# Altium project DIT_board.PrjPcb
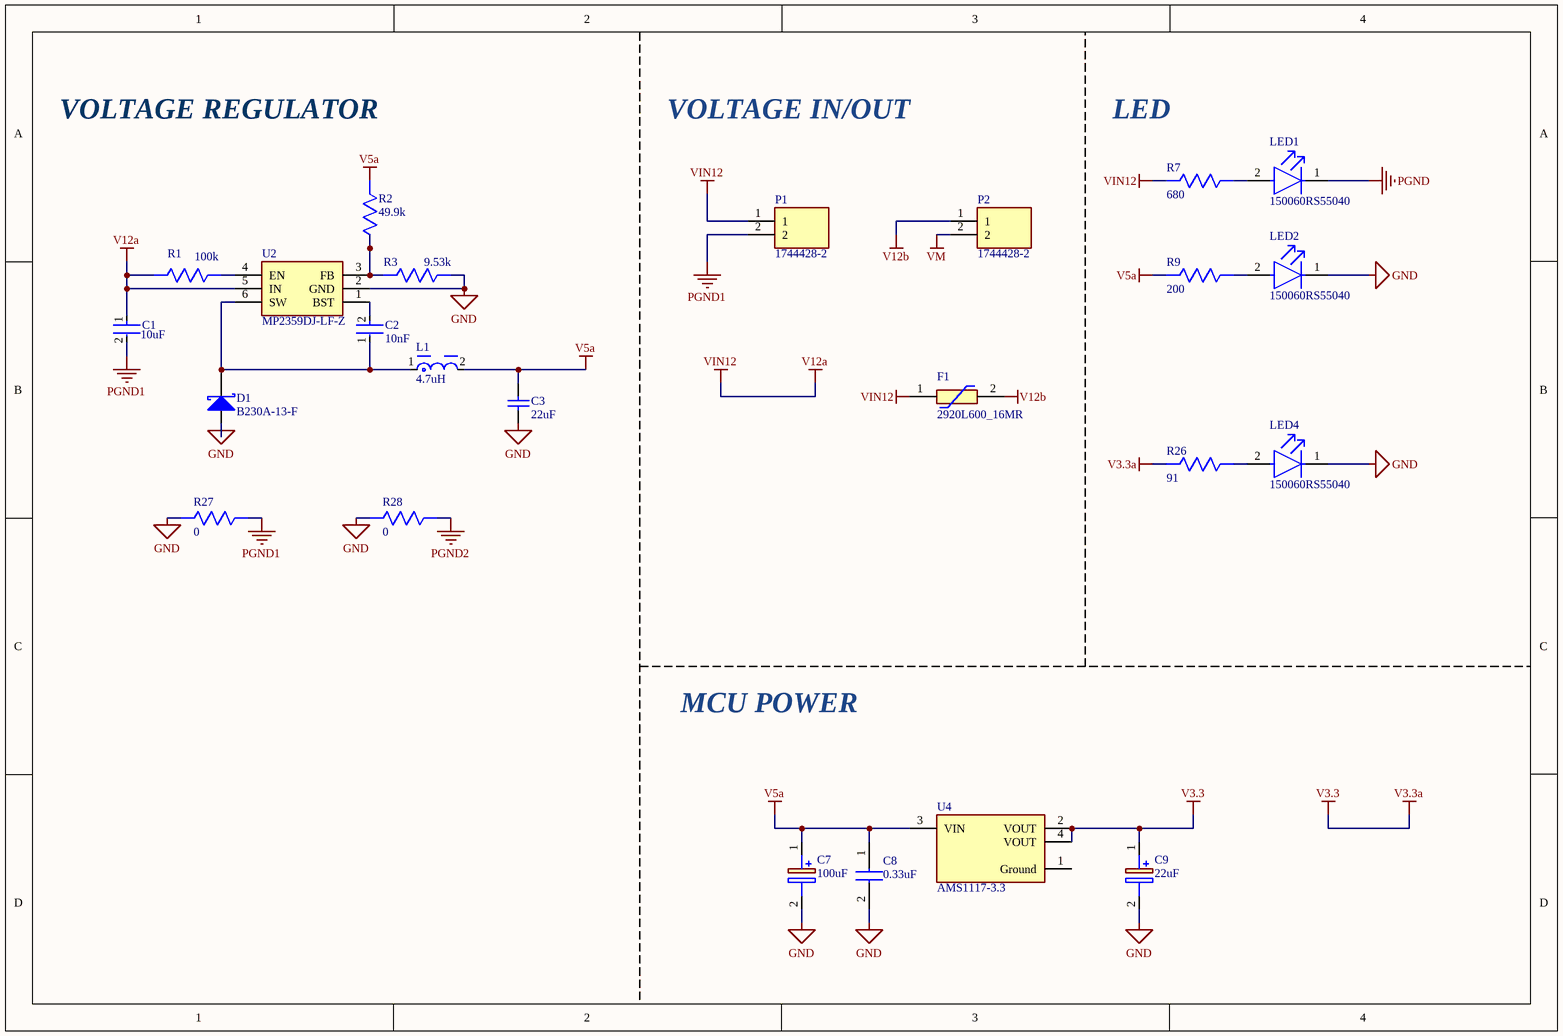
[diagram p0: VoltageRegulator.SchDoc]
4 sheets, 83 parts. Net scope: flat (ports and power ports of the same name join across sheets).
Board file: DIT_board.PcbDoc
Sheets:
  VoltageRegulator.SchDoc
  Motor.SchDoc
  STM32.SchDoc
  Communication.SchDoc

## Sheet VoltageRegulator.SchDoc
size A4; SheetNumber: 1; SheetTotal: 4

### Parts
C1  10uF  [FP-C1608-080-IPC_A]
C2  10nF  [FP-C1608-080-0_1-MFG]
C3  22uF  [CAPC1608X100X20ML10]
C7  100uF  [T495E]
C8  0.33uF  [C1608_Commercial]
C9  22uF  [T495C]
D1  B230A-13-F  [DIOD-SMA-2_V]
F1  2920L600_16MR  [FUSC7451X160N]
L1  4.7uH  [FP-7440530047-MFG]
LED1  150060RS55040  [FP-150060RS55040-MFG]
LED2  150060RS55040  [FP-150060RS55040-MFG]
LED4  150060RS55040  [FP-150060RS55040-MFG]
P1  1744428-2  [17444282]
P2  1744428-2  [17444282]
R1  100k  [RESC1608X55N]
R2  49.9k  [RESC1608X55N]
R3  9.53k  [RESC1608X55N]
R7  680  [RESC1608X55N]
R9  200  [RESC1608X55N]
R26  91  [RESC1608X55N]
R27  0  [RESC1608X55N]
R28  0  [RESC1608X55N]
U2  MP2359DJ-LF-Z  [SOT95P280X100-6N]
U4  AMS1117-3.3  [FP-AMS1117-IPC_C]

### Nets
GND: C3.1 C7.2(-) C8.2 C9.2(-) D1.1(A) LED2.1(C) LED4.1(C) R3.2 R27.1 R28.1 U2.2(GND)
PGND: LED1.1(C)
PGND1: C1.2 P1.2 R27.2
PGND2: R28.2
V3.3: C9.1(+) R26.1 U4.2(VOUT) U4.4(VOUT)  [also labelled V3.3a]
V5a: C3.2 C7.1(+) C8.1 L1.2 R2.1 R9.1 U4.3(VIN)
V12a: C1.1 F1.1 P1.1 R1.1 R7.1 U2.5(IN)  [also labelled VIN12]
V12b: F1.2 P2.1
VM: P2.2
NetC2_1: C2.1 D1.2(K) L1.1 U2.6(SW)
NetC2_2: C2.2 U2.1(BST)
NetLED1_2: LED1.2(A) R7.2
NetLED2_2: LED2.2(A) R9.2
NetLED4_2: LED4.2(A) R26.2
NetR1_2: R1.2 U2.4(EN)
NetR2_2: R2.2 R3.1 U2.3(FB)

Not connected (* = marked no-connect by the designer): U4 1(Ground)

### Notes on the sheet
- VOLTAGE REGULATOR
- VOLTAGE IN/OUT
- LED
- MCU POWER

### Library data of the parts
C1 = CMP-2000-05442-2: CAP CER 10UF 25V X5R 0603; Dielectric Material: Ceramic; Tolerance: 20%; Dielectric: X5R; Length: 1.6mm; Termination: SMD/SMT; Depth: 0.8mm; RoHS Compliant: Yes; Construction: Flat; Weight: 7.1E-05oz; Thickness: 0.039inch; Packaging: Tape and Reel; Min Operating Temperature: -55°C; Case Code (Imperial): 0603; Case/Package: 0603; Height: 0.8mm; Case Code (Metric): 1608; Voltage Rating: 25V; Resistor Type: Ceramic; Voltage Rating (DC): 25V; Max Operating Temperature: 85°C; REACH SVHC: No SVHC; Lead Free: Lead Free; Series: C; Width: 0.8mm; Mount: Surface Mount; Package Quantity: 1; Capacitance: 10uF
C2 = CMP-08246-005687-1: Multilayer Ceramic Capacitors 10nF ±20% 50V X5R SMD 0603; Width: 0.031inch; Termination: SMD/SMT; Mount: Surface Mount; Voltage Rating (DC): 50V; Max Operating Temperature: 85°C; Case/Package: 0603; Dielectric: X5R; Length: 0.063inch; Package Quantity: 4000; Case Code (Metric): 1608; Capacitance: 10nF; Packaging: Tape and Reel; Lead Free: Lead Free; Tolerance: 20%; Case Code (Imperial): 0603; Resistor Type: Ceramic; Height: 0.8mm; Dielectric Material: Ceramic; RoHS Compliant: Yes; Min Operating Temperature: -55°C; Series: C; Voltage Rating: 50V; Thickness: 0.035inch
C3 = CMP-2000-05441-1: Chip Capacitor, 22 uF, +/- 20%, 10 V, -55 to 85 degC, 0603 (1608 Metric), RoHS, Tape and Reel; Manufacturer: TDK; PCN Part Number: MLCCPartNumberChange30/Nov/2012; Voltage - Rated: 10V; Product Training Modules: CSeriesGeneralApplicationsSEAT,CCV,andTVCLDesignToolsGuidetoReplacinganElectrolyticCapacitorwithanMLCC; Other Names: 445-9077-1; Design Resources: 20WNon-IsolatedBuckLEDDriverUsingPLLNK460KG; Online Catalog: CSeries,GeneralPurpose; Capacitance: 22µF; Temperature Coefficient: X5R; Kits: 445-9014-KIT-ND-KITMLCC100PF-22UF060310-50V; Packaging: CutTape(CT); Standard Package: 1; Package / Case: 0603(1608Metric); Lead Style: -; Features: -; Ratings: -; Operating Temperature: -55degC~85degC; Applications: GeneralPurpose; Package Reference: 603; Datasheet URL: http://download.siliconexpert.com/pdfs/2015/4/21/15/54/45/779/tdk_/manual/37024850441143360mlcc_commercial_general_en.pdf; Datasheet Version: Mar-15; Mounting Type: SurfaceMount,MLCC; Lead Spacing: -; Size / Dimension: 0.063"Lx0.031"W(1.60mmx0.80mm); Height - Seated (Max): -; Package Description: 2-Pin Surface Mount Device, Body 1.6 x 0.8 mm; Manufacturer URL: http://www.tdk.com/; RoHS Information: RoHSCertificate-MLCC; Tolerance: ±20%; Series: C; Thickness (Max): 0.035"(0.90mm); Family: CeramicCapacitors; Category: Capacitors
C7 = T495E107K025ATE100: Capacitor Polarised; Manufacturer_Name: KEMET; Datasheet Link: https://content.kemet.com/datasheets/KEM_T2009_T495.pdf; Height: 3.8mm; Manufacturer_Part_Number: T495E107K025ATE100; Mouser Part Number: 80-T495E107K025; Mouser Price/Stock: https://www.mouser.co.uk/ProductDetail/KEMET/T495E107K025ATE100?qs=m0jdfl4MgCkmn%2F5ccqVs1Q%3D%3D; Arrow Part Number: T495E107K025ATE100; Arrow Price/Stock: https://www.arrow.com/en/products/t495e107k025ate100/kemet-corporation
C8 = C1608X7R1H334K080AC: Capacitor; Manufacturer_Name: TDK; Datasheet Link: https://product.tdk.com/system/files/dam/doc/product/capacitor/ceramic/mlcc/catalog/mlcc_commercial_general_en.pdf; Height: 0.9mm; Manufacturer_Part_Number: C1608X7R1H334K080AC; Mouser Part Number: 810-C1608X7R1H334K; Mouser Price/Stock: https://www.mouser.co.uk/ProductDetail/TDK/C1608X7R1H334K080AC?qs=NRhsANhppD%252BuOqJgCMjUlg%3D%3D; Arrow Part Number: C1608X7R1H334K080AC; Arrow Price/Stock: https://www.arrow.com/en/products/c1608x7r1h334k080ac/tdk
C9 = T495C226K025ATE300: Capacitor Polarised; Manufacturer_Name: KEMET; Datasheet Link: https://content.kemet.com/datasheets/KEM_T2009_T495.pdf; Height: 2.8mm; Manufacturer_Part_Number: T495C226K025ATE300; Mouser Part Number: 80-T495C226K25E300; Mouser Price/Stock: https://www.mouser.co.uk/ProductDetail/KEMET/T495C226K025ATE300?qs=bQqEcw2qv2Rc8vCMsxIK1A%3D%3D; Arrow Part Number: T495C226K025ATE300; Arrow Price/Stock: https://www.arrow.com/en/products/t495c226k025ate300/kemet-corporation
D1 = CMP-0905-00001-1: 2 A Surface Mount Schottky Barrier Rectifier, 30 V, -65 to 150 degC, 2-Pin SMA, RoHS, Tape and Reel; Manufacturer: Diodes Inc; VRRM: 30 V; IO: 2 A Max.; CT: 200 pF; IFSM: 50 A; VF: 0.5 V; IF: 2 A; ComponentLink1Description: Manufacturer URL; PackageDescription: 2-Pin SMA, Body 4.3 x 2.605 mm, Height 2.3 mm; Mounting Technology: Surface Mount; ComponentLink1URL: http://diodes.com/; VR: 30 V; PackageReference: SMA-2; RoHS: TRUE; ComponentLink2URL: http://diodes.com/datasheets/ds13004.pdf; Packing: Tape and Reel; DatasheetVersion: Rev. 21 - 2; ComponentLink2Description: Datasheet; Temperature Range: -65 to 150 degC; PartNumber: B230A-13-F
F1 = 2920L600_16MR: Resettable Fuse; Manufacturer_Name: LITTELFUSE; Manufacturer_Part_Number: 2920L600/16MR; Datasheet Link: https://m.littelfuse.com/~/media/electronics/datasheets/resettable_ptcs/littelfuse_ptc_2920l_datasheet.pdf.pdf; Height: 1.6mm
L1 = CMP-0227-00415-2: FIXED IND 4.7UH 2.4A 38 MOHM SMD; Max DC Current: 2A; Series Resistance: 38mR; Core Material: Ferrite; Inductance Tolerance: 30%; Shielding: Shielded; Self Resonant Frequency: 40MHz; Test Frequency: 100kHz; Saturation Current: 1.95A; Case/Package: 2323; Resistor Type: Wirewound; Case Code (Imperial): 2323; Depth: 5.8mm; Mount: Surface Mount; Case Code (Metric): 5858; Min Operating Temperature: -40°C; RoHS Compliant: Yes; Series: WE-TPC; Lead Free: Lead Free; Height: 2.8mm; RMS Current (Irms): 2.4A; Weight: 0.013334oz; Packaging: Cut Tape; Width: 5.8mm; Height - Seated (Max): 0.118inch; Package Quantity: 1; Number of Pins: 2; Termination: SMD/SMT; Inductance: 4.7uH; Max Operating Temperature: 125°C; Length: 5.8mm; Current Rating: 2.4A; Tolerance: 30%; DC Resistance (DCR): 38mR
LED1 LED2 LED4 = CMP-207942-000007-1: LED RED DIFFUSED 0603 SMD; Lens Style: Flat; Lens Size: 0.8mm; Luminous Intensity: 90mcd; Test Current: 20mA; Forward Voltage: 2V; Dominant Wavelength: 624nm; Viewing Angle: 140°; Width: 0.8mm; Mount: Surface Mount; Height: 0.5mm; Case/Package: 0603; Packaging: Cut Tape; Length: 1.6mm; RoHS Compliant: No; Color: Red; Case Code (Imperial): 0603; Lens Transparency: Diffused; Case Code (Metric): 1608
P1 P2 = 1744428-2: Connector; Manufacturer_Name: TE Connectivity; Datasheet Link: https://www.te.com/commerce/DocumentDelivery/DDEController?Action=srchrtrv&DocNm=1744428&DocType=Customer+Drawing&DocLang=English; Height: 8.8mm; Manufacturer_Part_Number: 1744428-2; Mouser Part Number: 571-1744428-2; Mouser Price/Stock: https://www.mouser.co.uk/ProductDetail/TE-Connectivity/1744428-2?qs=%2F6W%2F9%2FHWvcDoOfykajFB2Q%3D%3D
R1-R3 R7 R9 R26-R28 = CMP0603-FX-1003ELF: Resistor; Manufacturer_Name: Bourns; Datasheet Link: https://www.mouser.co.uk/datasheet/2/54/Bourns_CMP_Datasheet_05.28.20-1854233.pdf; Height: 0.55mm; Manufacturer_Part_Number: CMP0603-FX-1003ELF
U2 = MP2359DJ-LF-Z: Integrated Circuit; Manufacturer_Name: Monolithic Power Systems (MPS); Datasheet Link: https://componentsearchengine.com//MP2359DJ-LF-Z.pdf; Height: 1mm; Mouser2 Part Number: 946-MP2359DJLFZ; Mouser2 Price/Stock: https://www.mouser.com/Search/Refine.aspx?Keyword=946-MP2359DJLFZ; Manufacturer_Part_Number: MP2359DJ-LF-Z
U4 = CMP-209535-000001-1: LDO Voltage Regulators 1A, 3.3V; Manufacturer: Advanced Monolithic Systems; Dropout Voltage: 1.1V; Output Type: Fixed; Nominal Supply Current: 5mA; Max Power Dissipation: 1.2W; Max Supply Voltage: 15V; Number Of Outputs: 1; Standoff Height: 0.64mm; Max Junction Temp: +125°C; Height: 1.8mm; Package: AMS1117; Device Class L2: Power Management ICs; ComponentLink2Description: Datasheet; ComponentLink2URL: http://www.advanced-monolithic.com/pdf/ds1117.pdf; Category: IC; RoHS: TRUE; Automotive: No; Device Class L1: Integrated Circuits (ICs); Output Current: 1A; Device Class L3: Voltage Regulators - Linear; Temperature: -40°C to +125°C; Output Voltage: 3.3V; Manufacturer Part Number: AMS1117-3.3; Temperature Range Low: -40°C; Octopart: https://octopart.com/ams1117-3.3-advanced+monolithic+systems-25899300; Lead Free: Yes; Ipc Land Pattern Name: SOT229P700X180-4; Temperature Range High: +125°C

## Sheet Motor.SchDoc
size A4; SheetNumber: 2; SheetTotal: 4
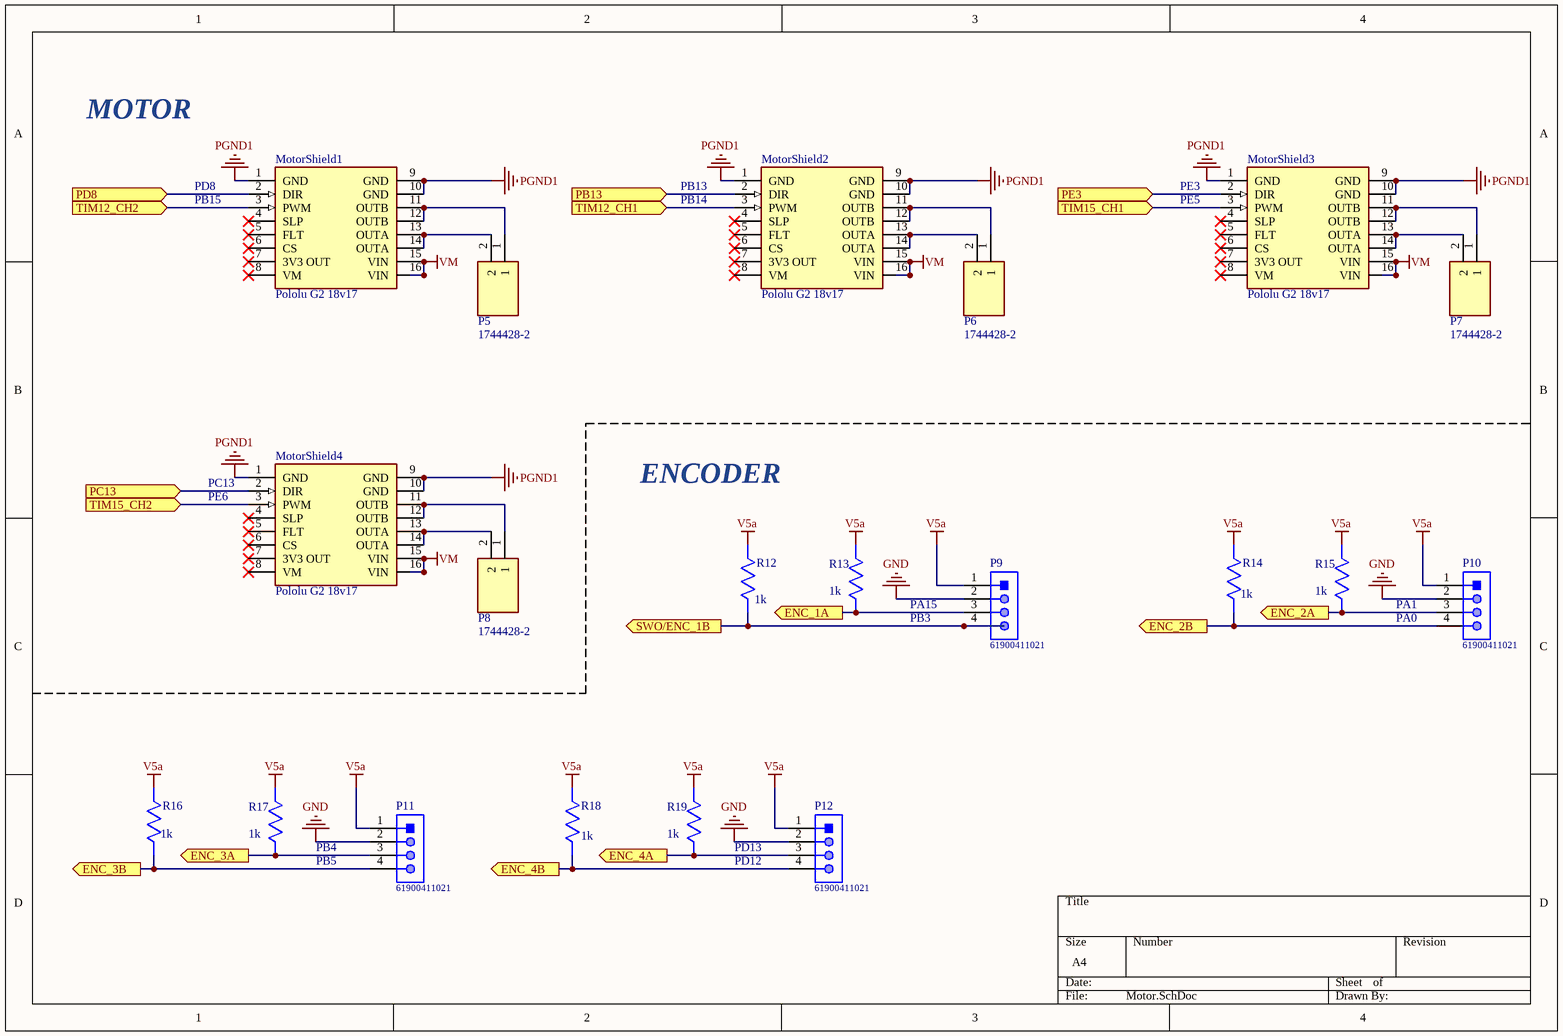
[diagram p1: Motor.SchDoc]

### Parts
MotorShield1  Pololu G2 18v17  [Pololu G218V17]
MotorShield2  Pololu G2 18v17  [Pololu G218V17]
MotorShield3  Pololu G2 18v17  [Pololu G218V17]
MotorShield4  Pololu G2 18v17  [Pololu G218V17]
P5  1744428-2  [17444282]
P6  1744428-2  [17444282]
P7  1744428-2  [17444282]
P8  1744428-2  [17444282]
P9  61900411021  [61900411021]
P10  61900411021  [61900411021]
P11  61900411021  [61900411021]
P12  61900411021  [61900411021]
R12  1k  [RESC1608X55N]
R13  1k  [RESC1608X55N]
R14  1k  [RESC1608X55N]
R15  1k  [RESC1608X55N]
R16  1k  [RESC1608X55N]
R17  1k  [RESC1608X55N]
R18  1k  [RESC1608X55N]
R19  1k  [RESC1608X55N]

### Ports
ENC_1A (out, see STM32[1C]), ENC_2A (out, see STM32[1B]), ENC_2B (out, see STM32[1B]), ENC_3A (out, see STM32[1C]), ENC_3B (out, see STM32[1C]), ENC_4A (out, see STM32[2D]), ENC_4B (out, see STM32[2D]), PB13 (in, see STM32[1D]), PC13 (in, see STM32[2C]), PD8 (in, see STM32[2D]), PE3 (in, see STM32[2A]), SWO/ENC_1B (out, see STM32[1C]), TIM12_CH1 (in, see STM32[1D]), TIM12_CH2 (in, see STM32[1D]), TIM15_CH1 (in, see STM32[2A]), TIM15_CH2 (in, see STM32[2A])

### Nets
GND: P9.2 P10.2 P11.2 P12.2
PGND1: MotorShield1.1(GND) MotorShield1.9(GND) MotorShield1.10(GND) MotorShield2.1(GND) MotorShield2.9(GND) MotorShield2.10(GND) MotorShield3.1(GND) MotorShield3.9(GND) MotorShield3.10(GND) MotorShield4.1(GND) MotorShield4.9(GND) MotorShield4.10(GND)
V5a: P9.1 P10.1 P11.1 P12.1 R12.2 R13.2 R14.2 R15.2 R16.2 R17.2 R18.2 R19.2
VM: MotorShield1.15(VIN) MotorShield1.16(VIN) MotorShield2.15(VIN) MotorShield2.16(VIN) MotorShield3.15(VIN) MotorShield3.16(VIN) MotorShield4.15(VIN) MotorShield4.16(VIN)
NetMotorShield1_2: MotorShield1.2(DIR) ; port PD8
NetMotorShield1_3: MotorShield1.3(PWM) ; port TIM12_CH2
NetMotorShield1_11: MotorShield1.11(OUTB) MotorShield1.12(OUTB) P5.1
NetMotorShield1_13: MotorShield1.13(OUTA) MotorShield1.14(OUTA) P5.2
NetMotorShield2_2: MotorShield2.2(DIR) ; port PB13
NetMotorShield2_3: MotorShield2.3(PWM) ; port TIM12_CH1
NetMotorShield2_11: MotorShield2.11(OUTB) MotorShield2.12(OUTB) P6.1
NetMotorShield2_13: MotorShield2.13(OUTA) MotorShield2.14(OUTA) P6.2
NetMotorShield3_2: MotorShield3.2(DIR) ; port PE3
NetMotorShield3_3: MotorShield3.3(PWM) ; port TIM15_CH1
NetMotorShield3_11: MotorShield3.11(OUTB) MotorShield3.12(OUTB) P7.1
NetMotorShield3_13: MotorShield3.13(OUTA) MotorShield3.14(OUTA) P7.2
NetMotorShield4_2: MotorShield4.2(DIR) ; port PC13
NetMotorShield4_3: MotorShield4.3(PWM) ; port TIM15_CH2
NetMotorShield4_11: MotorShield4.11(OUTB) MotorShield4.12(OUTB) P8.1
NetMotorShield4_13: MotorShield4.13(OUTA) MotorShield4.14(OUTA) P8.2
NetP9_3: P9.3 R13.1 ; port ENC_1A
NetP9_4: P9.4 R12.1 ; port SWO/ENC_1B
NetP10_3: P10.3 R15.1 ; port ENC_2A
NetP10_4: P10.4 R14.1 ; port ENC_2B
NetP11_3: P11.3 R17.1 ; port ENC_3A
NetP11_4: P11.4 R16.1 ; port ENC_3B
NetP12_3: P12.3 R19.1 ; port ENC_4A
NetP12_4: P12.4 R18.1 ; port ENC_4B

Not connected (* = marked no-connect by the designer): MotorShield1 4(SLP)* 5(FLT)* 6(CS)* 7(3V3_OUT)* 8(VM)*; MotorShield2 4(SLP)* 5(FLT)* 6(CS)* 7(3V3_OUT)* 8(VM)*; MotorShield3 4(SLP)* 5(FLT)* 6(CS)* 7(3V3_OUT)* 8(VM)*; MotorShield4 4(SLP)* 5(FLT)* 6(CS)* 7(3V3_OUT)* 8(VM)*

### Notes on the sheet
- MOTOR
- PB15
- PD8
- PB14
- PB13
- (near MotorShield3) PE5
- (near MotorShield3) PE3
- (near MotorShield4) PE6
- (near MotorShield4) PC13
- ENCODER
- PA15
- PB3
- PA1
- PA0
- PB4
- PD13
- PB5
- PD12

### Library data of the parts
MotorShield1-MotorShield4 = Pololu G2 18v17: DC Motor Driver
P5-P8 = 1744428-2: as P1 on sheet VoltageRegulator; Datasheet Link: https://www.te.com/commerce/DocumentDelivery/DDEController?Action=srchrtrv&DocNm=1744428&DocType=Customer+Drawing&DocLang=English; Height: 8.8mm; Manufacturer_Part_Number: 1744428-2; Mouser Part Number: 571-1744428-2; Mouser Price/Stock: https://www.mouser.co.uk/ProductDetail/TE-Connectivity/1744428-2?qs=%2F6W%2F9%2FHWvcDoOfykajFB2Q%3D%3D
P9-P12 = CMP-1502-00594-1: Male Bottom Locking Header WR-WTB, THT, Right Angled, pitch 2.54 mm, 1 x 4 position; Manufacturer: Wurth Elektronik; Position: 1x4; Working Voltage: 250VAC; Pitch: 2.54mm; Contact Resistance: 20mOhm; Part Number: 61900411021; Operating Temperature: -40to105degC; Orientation: RightAngled; Packaging: Bag; Datasheet URL: https://katalog.we-online.de/em/datasheet/6190xx11021.pdf; Package Reference: 61900411021; Publisher: WurthElektronik; Mounting Technology: THT; Manufacturer URL: http://www.we-online.de; Gender: Male
R12-R19 = CMP0603-FX-1003ELF: Resistor; Manufacturer_Name: Bourns; Datasheet Link: https://www.mouser.co.uk/datasheet/2/54/Bourns_CMP_Datasheet_05.28.20-1854233.pdf; Height: 0.55mm; Manufacturer_Part_Number: CMP0603-FX-1003ELF

## Sheet STM32.SchDoc: STM32
size A4; SheetNumber: 3; SheetTotal: 4
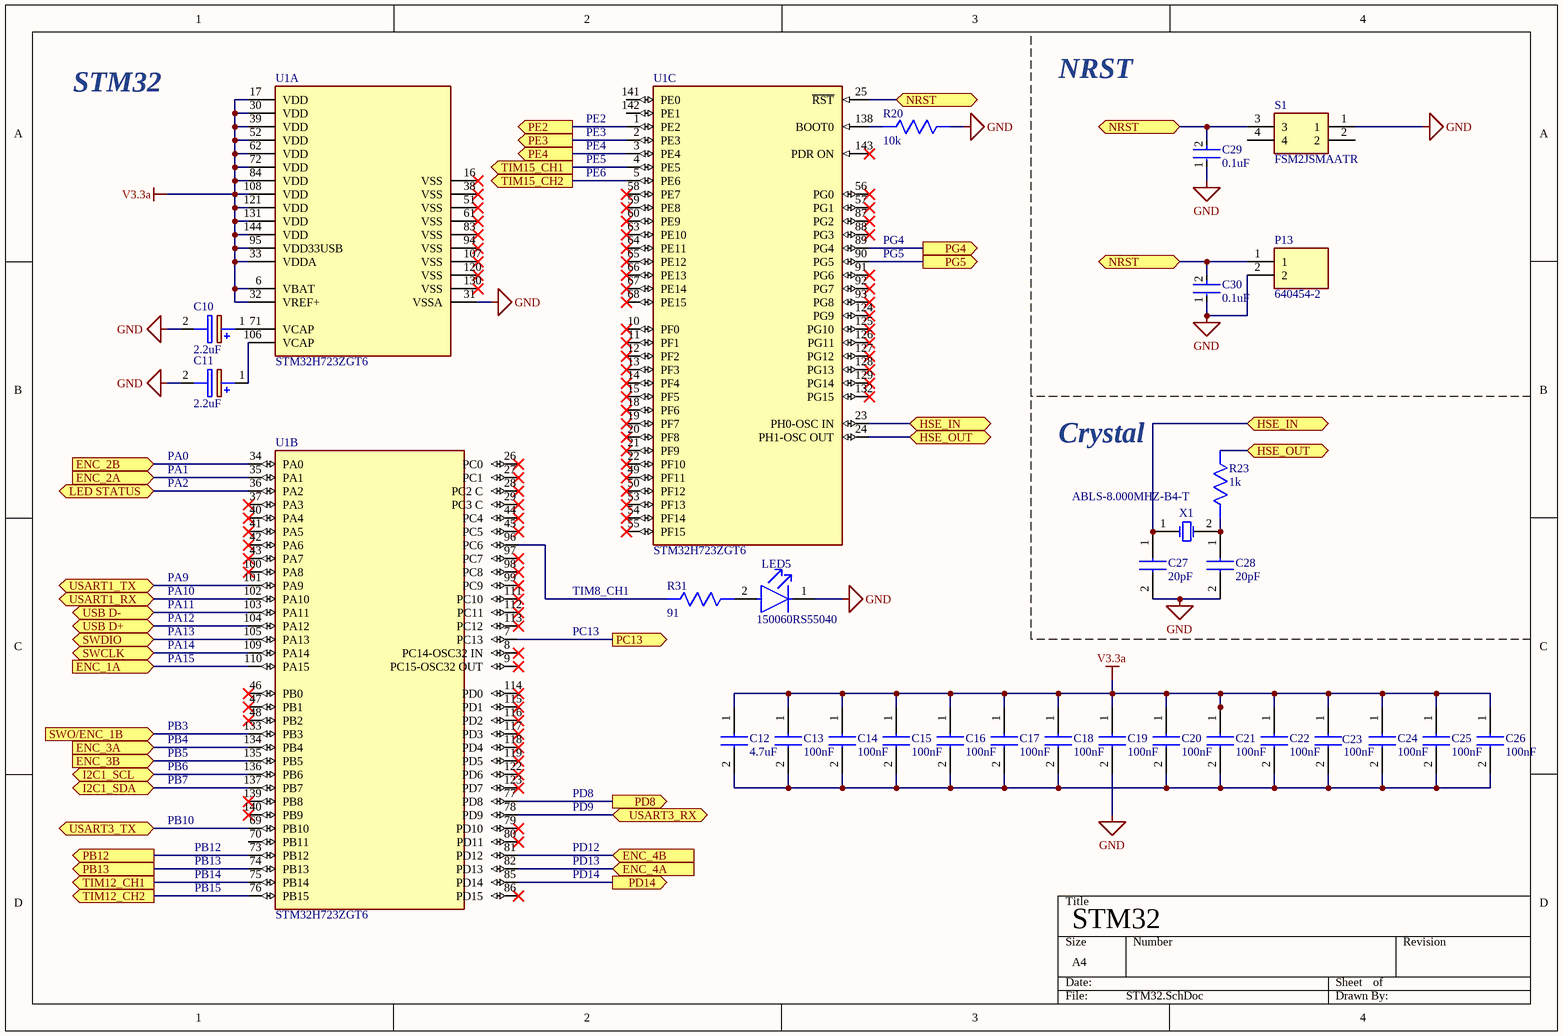
[diagram p2: STM32.SchDoc]

### Parts
C10  2.2uF  [T491D]
C11  2.2uF  [T491D]
C12  4.7uF  [C1608_Commercial]
C13  100nF  [C1608_Commercial]
C14  100nF  [C1608_Commercial]
C15  100nF  [C1608_Commercial]
C16  100nF  [C1608_Commercial]
C17  100nF  [C1608_Commercial]
C18  100nF  [C1608_Commercial]
C19  100nF  [C1608_Commercial]
C20  100nF  [C1608_Commercial]
C21  100nF  [C1608_Commercial]
C22  100nF  [C1608_Commercial]
C23  100nF  [C1608_Commercial]
C24  100nF  [C1608_Commercial]
C25  100nF  [C1608_Commercial]
C26  100nF  [C1608_Commercial]
C27  20pF  [CAPC1608X90N]
C28  20pF  [CAPC1608X90N]
C29  0.1uF  [FP-C1608-080-0_1-IPC_A]
C30  0.1uF  [FP-C1608-080-0_1-IPC_A]
LED5  150060RS55040  [FP-150060RS55040-MFG]
P13  640454-2  [HDRV2W66P0X254_1X2_762X572X1003P]
R20  10k  [RESC1608X55N]
R23  1k  [RESC1608X55N]
R31  91  [RESC1608X55N]
S1  FSM2JSMAATR  [FSM2J_1]
U1  STM32H723ZGT6  [FP-LQFP144-1A-IPC_C]  (parts A,B,C of 3)
X1  ABLS-8.000MHZ-B4-T  [ABRA-ABLS-14.7456MHZ-B2-T_V]

### Ports
ENC_1A (in, see Motor[2C]), ENC_2A (in, see Motor[4C]), ENC_2B (in, see Motor[3C]), ENC_3A (in, see Motor[1D]), ENC_3B (in, see Motor[1D]), ENC_4A (in, see Motor[2D]), ENC_4B (in, see Motor[2D]), HSE_IN (bidir, see STM32[3B]), HSE_IN (bidir, see STM32[4B]), HSE_OUT (bidir, see STM32[3B]), HSE_OUT (bidir, see STM32[4B]), I2C1_SCL (bidir), I2C1_SDA (bidir), LED STATUS (bidir), NRST (bidir, see Communication[1D], STM32[3A]), NRST (bidir, see Communication[1D], STM32[3A], STM32[3B]), PB12 (out), PB13 (out, see Motor[2A]), PC13 (out, see Motor[1B]), PD8 (out, see Motor[1A]), PD14 (out), PE2 (out), PE3 (out, see Motor[3A]), PE4 (out), PG4 (out, see Communication[2B]), PG5 (out, see Communication[3B]), SWCLK (bidir), SWDIO (bidir), SWO/ENC_1B (in, see Motor[2C]), TIM12_CH1 (out, see Motor[2A]), TIM12_CH2 (out, see Motor[1A]), TIM15_CH1 (out, see Motor[3A]), TIM15_CH2 (out, see Motor[1B]), USART1_RX (bidir), USART1_TX (bidir), USART3_RX (bidir), USART3_TX (bidir), USB D+ (bidir), USB D- (bidir)

### Nets
GND: C10.2(-) C11.2(-) C19.2 C27.2 C28.2 C29.1 C30.1 LED5.1(C) P13.2 R20.2 S1.1 U1.31(VSSA)
V3.3a: C12.1 C13.1 C14.1 C15.1 C16.1 C17.1 C18.1 C19.1 C20.1 C21.1 C22.1 C23.1 C24.1 C25.1 C26.1 U1.6(VBAT) U1.17(VDD) U1.30(VDD) U1.32(VREF+) U1.33(VDDA) U1.39(VDD) U1.52(VDD) U1.62(VDD) U1.72(VDD) U1.84(VDD) U1.95(VDD33USB) U1.108(VDD) U1.121(VDD) U1.131(VDD) U1.144(VDD)  [project net V3.3]
NetC10_1: C10.1(+) U1.71(VCAP)
NetC11_1: C11.1(+) U1.106(VCAP)
NetC12_2: C12.2 C13.2 C14.2 C15.2 C16.2 C17.2 C18.2 C20.2 C21.2 C22.2 C23.2 C24.2 C25.2 C26.2
NetC27_1: C27.1 U1.23(PH0-OSC_IN) X1.1(X1) ; port HSE_IN
NetC28_1: C28.1 R23.1 X1.2(X2)
NetC29_2: C29.2 C30.2 P13.1 S1.3 U1.25(~{RST}) ; port NRST
NetLED5_2: LED5.2(A) R31.2
NetMotorShield1_2: U1.77(PD8) ; port PD8
NetMotorShield1_3: U1.76(PB15) ; port TIM12_CH2
NetMotorShield2_2: U1.74(PB13) ; port PB13
NetMotorShield2_3: U1.75(PB14) ; port TIM12_CH1
NetMotorShield3_2: U1.2(PE3) ; port PE3
NetMotorShield3_3: U1.4(PE5) ; port TIM15_CH1
NetMotorShield4_2: U1.7(PC13) ; port PC13
NetMotorShield4_3: U1.5(PE6) ; port TIM15_CH2
NetP9_3: U1.110(PA15) ; port ENC_1A
NetP9_4: U1.133(PB3) ; port SWO/ENC_1B
NetP10_3: U1.35(PA1) ; port ENC_2A
NetP10_4: U1.34(PA0) ; port ENC_2B
NetP11_3: U1.134(PB4) ; port ENC_3A
NetP11_4: U1.135(PB5) ; port ENC_3B
NetP12_3: U1.82(PD13) ; port ENC_4A
NetP12_4: U1.81(PD12) ; port ENC_4B
NetP18_1: U1.89(PG4) ; port PG4
NetP19_1: U1.90(PG5) ; port PG5
NetR20_1: R20.1 U1.138(BOOT0)
NetR23_2: R23.2 U1.24(PH1-OSC_OUT) ; port HSE_OUT
NetR31_1: R31.1 U1.96(PC6)
NetU1_1: U1.1(PE2) ; port PE2
NetU1_3: U1.3(PE4) ; port PE4
NetU1_36: U1.36(PA2) ; port LED STATUS
NetU1_69: U1.69(PB10) ; port USART3_TX
NetU1_73: U1.73(PB12) ; port PB12
NetU1_78: U1.78(PD9) ; port USART3_RX
NetU1_85: U1.85(PD14) ; port PD14
NetU1_101: U1.101(PA9) ; port USART1_TX
NetU1_102: U1.102(PA10) ; port USART1_RX
NetU1_103: U1.103(PA11) ; port USB D-
NetU1_104: U1.104(PA12) ; port USB D+
NetU1_105: U1.105(PA13) ; port SWDIO
NetU1_109: U1.109(PA14) ; port SWCLK
NetU1_136: U1.136(PB6) ; port I2C1_SCL
NetU1_137: U1.137(PB7) ; port I2C1_SDA

Not connected (* = marked no-connect by the designer): S1 2 4; U1 8(PC14-OSC32_IN)* 9(PC15-OSC32_OUT)* 10(PF0)* 11(PF1)* 12(PF2)* 13(PF3)* 14(PF4)* 15(PF5)* 16(VSS)* 18(PF6)* 19(PF7)* 20(PF8)* 21(PF9)* 22(PF10)* 26(PC0)* 27(PC1)* 28(PC2_C)* 29(PC3_C)* 37(PA3)* 38(VSS)* 40(PA4)* 41(PA5)* 42(PA6)* 43(PA7)* 44(PC4)* 45(PC5)* 46(PB0)* 47(PB1)* 48(PB2)* 49(PF11)* 50(PF12)* 51(VSS)* 53(PF13)* 54(PF14)* 55(PF15)* 56(PG0)* 57(PG1)* 58(PE7)* 59(PE8)* 60(PE9)* 61(VSS)* 63(PE10)* 64(PE11)* 65(PE12)* 66(PE13)* 67(PE14)* 68(PE15)* 70(PB11) 79(PD10)* 80(PD11)* 83(VSS)* 86(PD15)* 87(PG2)* 88(PG3)* 91(PG6)* 92(PG7)* 93(PG8)* 94(VSS)* 97(PC7)* 98(PC8)* 99(PC9)* 100(PA8)* 107(VSS)* 111(PC10)* 112(PC11)* 113(PC12)* 114(PD0)* 115(PD1)* 116(PD2)* 117(PD3)* 118(PD4)* 119(PD5)* 120(VSS)* 122(PD6)* 123(PD7)* 124(PG9)* 125(PG10)* 126(PG11)* 127(PG12)* 128(PG13)* 129(PG14)* 130(VSS)* 132(PG15)* 139(PB8)* 140(PB9)* 141(PE0) 142(PE1) 143(PDR_ON)*

### Notes on the sheet
- STM32
- NRST
- (near U1) PE5
- (near U1) PE6
- (near U1) PE4
- (near U1) PE3
- (near U1) PE2
- (near U1) PG4
- (near U1) PG5
- Crystal
- PA2
- PA1
- PA0
- PA9
- PA13
- PA14
- PA12
- PA11
- PA10
- PC13
- TIM8_CH1
- PA15
- PB3
- PB6
- PB7
- PB4
- PB5
- PB10
- PB12
- PD9
- PD8
- PD12
- PB15
- PB14
- PB13
- PD14
- PD13

### Library data of the parts
C10 C11 = T491D225K050AH: Capacitor Polarised; Manufacturer_Name: KEMET; Datasheet Link: https://content.kemet.com/datasheets/KEM_T2005_T491.pdf; Height: 3.1mm; Manufacturer_Part_Number: T491D225K050AH
C12-C26 = C1608X5R1H104M080AA: Capacitor; Manufacturer_Name: TDK; Datasheet Link: https://product.tdk.com/system/files/dam/doc/product/capacitor/ceramic/mlcc/catalog/mlcc_commercial_general_en.pdf; Height: 0.9mm; Manufacturer_Part_Number: C1608X5R1H104M080AA
C27 C28 = 06035A200FAT2A: Capacitor; Manufacturer_Name: AVX; Datasheet Link: https://componentsearchengine.com/Datasheets/1/06031A100FAT2A.pdf; Height: 0.9mm; Manufacturer_Part_Number: 06035A200FAT2A; Mouser Part Number: 581-06035A200FAT2A; Mouser Price/Stock: https://www.mouser.co.uk/ProductDetail/AVX/06035A200FAT2A?qs=0yaOSdwiqWsd0YnmvPoF5Q%3D%3D
C29 C30 = CMP-08246-002719-1: Multilayer Ceramic Capacitors 100nF ±10% 50V X5R SMD 0603; Radiation Hardening: No; Length: 1.6mm; Package Quantity: 1; Thickness: 0.035inch; Max Operating Temperature: 85°C; Series: C; RoHS Compliant: Yes; Weight: 7.1E-05oz; Resistor Type: Ceramic; Case/Package: 0603; Voltage Rating: 50V; Tolerance: 10%; Width: 0.031inch; Voltage Rating (DC): 50V; Termination: SMD/SMT; Case Code (Metric): 1608; Construction: Flat; Mount: Surface Mount; Capacitance: 100nF; Dielectric Material: Ceramic; Number of Pins: 2; Lead Free: Lead Free; Packaging: Tape and Reel; Min Operating Temperature: -55°C; Dielectric: X5R; Case Code (Imperial): 0603; Depth: 0.8mm; Height: 0.8mm; REACH SVHC: No SVHC
LED5 = CMP-207942-000007-1: as LED1 on sheet VoltageRegulator; Width: 0.8mm; Mount: Surface Mount; Height: 0.5mm; Case/Package: 0603; Packaging: Cut Tape; Length: 1.6mm; RoHS Compliant: No; Color: Red; Case Code (Imperial): 0603; Lens Transparency: Diffused; Case Code (Metric): 1608
P13 = 640454-2: Connector; Manufacturer_Name: TE Connectivity; Datasheet Link: https://datasheet.datasheetarchive.com/originals/distributors/Datasheets_SAMA/0152b3901a0ba380c7a54e62cba96e15.pdf; Height: 10.03mm; Manufacturer_Part_Number: 640454-2
R20 R23 R31 = CMP0603-FX-1003ELF: Resistor; Manufacturer_Name: Bourns; Datasheet Link: https://www.mouser.co.uk/datasheet/2/54/Bourns_CMP_Datasheet_05.28.20-1854233.pdf; Height: 0.55mm; Manufacturer_Part_Number: CMP0603-FX-1003ELF
S1 = FSM2JSMAATR: Switch; Manufacturer_Name: TE Connectivity; Datasheet Link: http://www.te.com/commerce/DocumentDelivery/DDEController?Action=showdoc&DocId=Customer+Drawing%7F2-1437565-7%7FV%7Fpdf%7FEnglish%7FENG_CD_2-1437565-7_V.pdf%7F2-1437565-9; Manufacturer_Part_Number: FSM2JSMAATR
U1 = CMP-12105-000148-1: IC MCU 32BIT 1MB FLASH 144LQFP
X1 = CMP-2000-05726-1: Low Profile Crystal, 8.0 MHz, +/- 30 ppm, -20 to 70 degC, 2-Pin SMD, RoHS, Tape and Reel; Brand: ABRACON; Case Length: 11.4mm; Frequency Stability: 50PPM; ESR: 80Ohms; Case Height: 4.2mm; Tolerance: 30PPM; Frequency: 8MHz; Case Width: 4.7mm; Load Capacitance: 18pF; Datasheet Version: 04/2011; Termination Style: SMD/SMT; Dimensions: 4.7mmWx11.4mmLx4.2mmH; Packaging: Reel; Manufacturer: ABRACON; Package URL: http://www.abracon.com/Support/PackageDrawing/Resonators/ABLS-2D.pdf; Mounting Technology: SurfaceMount; Package Reference: ABLS-14.7456MHZ-B2-T; Product Category: Crystals; Package Description: 2-Pin Surface Mount Device, Body 11.4 x 4.7 mm; Package / Case: HC-49/US; Mounting Style: SMD/SMT; Operating Temperature Range: -20Cto+70C; Series: ABLS; Factory Pack Quantity: 1000; Datasheet URL: http://www.abracon.com/Resonators/abls.pdf; Manufacturer URL: http://www.abracon.com/; RoHS: Details; Type: LowProfileMicroprocessorCrystal

## Sheet Communication.SchDoc
size A4; SheetNumber: 4; SheetTotal: 4
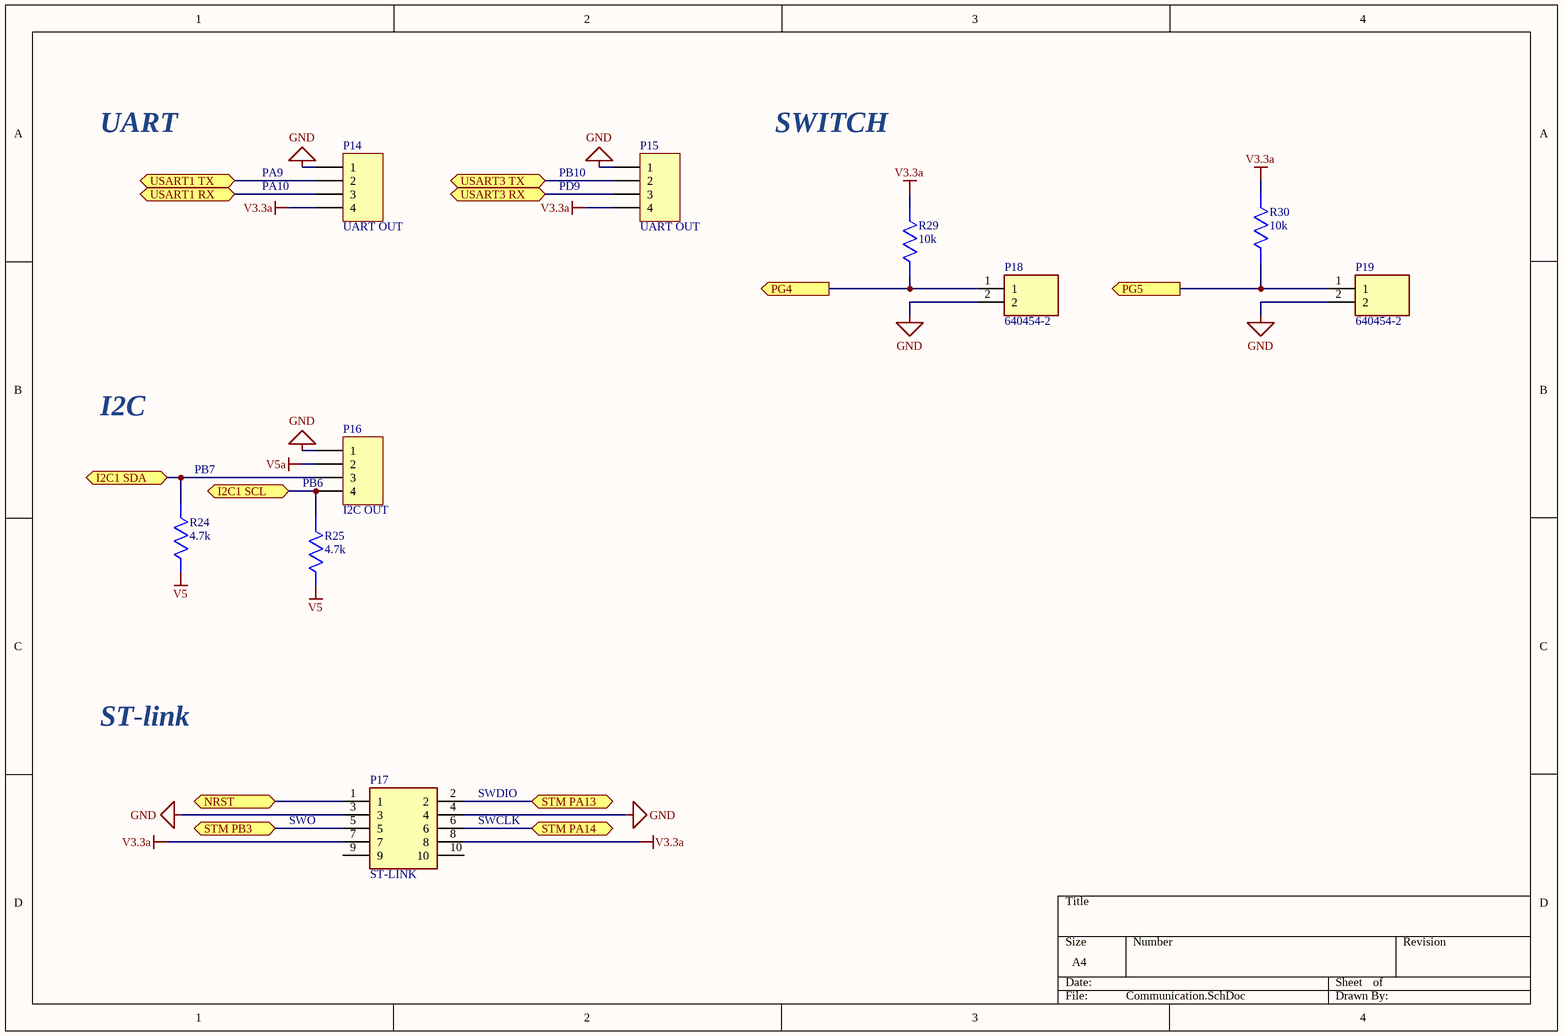
[diagram p3: Communication.SchDoc]

### Parts
P14  UART OUT  [HDR1X4]
P15  UART OUT  [HDR1X4]
P16  I2C OUT  [HDR1X4]
P17  ST-LINK  [SHDR10W66P254_2X5_2035X880X920P]
P18  640454-2  [HDRV2W66P0X254_1X2_762X572X1003P]
P19  640454-2  [HDRV2W66P0X254_1X2_762X572X1003P]
R24  4.7k  [RESC1608X55N]
R25  4.7k  [RESC1608X55N]
R29  10k  [RESC1608X55N]
R30  10k  [RESC1608X55N]

### Ports
I2C1 SCL (bidir), I2C1 SDA (bidir), NRST (bidir, see STM32[3A], STM32[3B]), PG4 (out, see STM32[3A]), PG5 (out, see STM32[3B]), STM PA13 (bidir), STM PA14 (bidir), STM PB3 (bidir), USART1 RX (bidir), USART1 TX (bidir), USART3 RX (bidir), USART3 TX (bidir)

### Nets
GND: P14.1 P15.1 P16.1 P17.3 P17.4 P18.2 P19.2
V3.3a: P14.4 P15.4 P17.7 P17.8 R29.2 R30.2  [project net V3.3]
V5: R24.1 R25.1
V5a: P16.2
NetC29_2: P17.1 ; port NRST
NetP14_2: P14.2 ; port USART1 TX
NetP14_3: P14.3 ; port USART1 RX
NetP15_2: P15.2 ; port USART3 TX
NetP15_3: P15.3 ; port USART3 RX
NetP16_3: P16.3 R24.2 ; port I2C1 SDA
NetP16_4: P16.4 R25.2 ; port I2C1 SCL
NetP17_2: P17.2 ; port STM PA13
NetP17_5: P17.5 ; port STM PB3
NetP17_6: P17.6 ; port STM PA14
NetP18_1: P18.1 R29.1 ; port PG4
NetP19_1: P19.1 R30.1 ; port PG5

Not connected (* = marked no-connect by the designer): P17 9 10

### Notes on the sheet
- UART
- PA9
- PB10
- SWITCH
- PA10
- PD9
- I2C
- (near R24) PB7
- (near P16) PB6
- ST-link
- SWO
- (near P17) SWDIO
- (near P17) SWCLK

### Library data of the parts
P14-P16 = Header 4: Header, 4-Pin; LatestRevisionDate: 17-Jul-2002; LatestRevisionNote: Re-released for DXP Platform.; Publisher: Altium Limited
P17 = 1-1634688-0: Connector; Manufacturer_Name: TE Connectivity; Datasheet Link: https://componentsearchengine.com/Datasheets/2/1-1634688-0.pdf; Height: 9.2mm; Manufacturer_Part_Number: 1-1634688-0
P18 P19 = 640454-2: as P13 on sheet STM32; Datasheet Link: https://datasheet.datasheetarchive.com/originals/distributors/Datasheets_SAMA/0152b3901a0ba380c7a54e62cba96e15.pdf; Height: 10.03mm; Manufacturer_Part_Number: 640454-2
R24 R25 R29 R30 = CMP0603-FX-1003ELF: Resistor; Manufacturer_Name: Bourns; Datasheet Link: https://www.mouser.co.uk/datasheet/2/54/Bourns_CMP_Datasheet_05.28.20-1854233.pdf; Height: 0.55mm; Manufacturer_Part_Number: CMP0603-FX-1003ELF

## Nets that join several sheets
GND: VoltageRegulator (11 pins), Motor (P9.2 P10.2 P11.2 P12.2), STM32 (12 pins), Communication (7 pins)
PGND1: VoltageRegulator (C1.2 P1.2 R27.2), Motor (12 pins)
V3.3: VoltageRegulator (C9.1 R26.1 U4.2 U4.4), STM32 (30 pins), Communication (6 pins)
V5a: VoltageRegulator (7 pins), Motor (12 pins), Communication (P16.2)
VM: VoltageRegulator (P2.2), Motor (8 pins)
NetC29_2: STM32 (5 pins), Communication (P17.1)
NetMotorShield1_2: Motor (MotorShield1.2), STM32 (U1.77)
NetMotorShield1_3: Motor (MotorShield1.3), STM32 (U1.76)
NetMotorShield2_2: Motor (MotorShield2.2), STM32 (U1.74)
NetMotorShield2_3: Motor (MotorShield2.3), STM32 (U1.75)
NetMotorShield3_2: Motor (MotorShield3.2), STM32 (U1.2)
NetMotorShield3_3: Motor (MotorShield3.3), STM32 (U1.4)
NetMotorShield4_2: Motor (MotorShield4.2), STM32 (U1.7)
NetMotorShield4_3: Motor (MotorShield4.3), STM32 (U1.5)
NetP9_3: Motor (P9.3 R13.1), STM32 (U1.110)
NetP9_4: Motor (P9.4 R12.1), STM32 (U1.133)
NetP10_3: Motor (P10.3 R15.1), STM32 (U1.35)
NetP10_4: Motor (P10.4 R14.1), STM32 (U1.34)
NetP11_3: Motor (P11.3 R17.1), STM32 (U1.134)
NetP11_4: Motor (P11.4 R16.1), STM32 (U1.135)
NetP12_3: Motor (P12.3 R19.1), STM32 (U1.82)
NetP12_4: Motor (P12.4 R18.1), STM32 (U1.81)
NetP18_1: STM32 (U1.89), Communication (P18.1 R29.1)
NetP19_1: STM32 (U1.90), Communication (P19.1 R30.1)